# Altium schematic sheet PULSERA.SchDoc
size A4
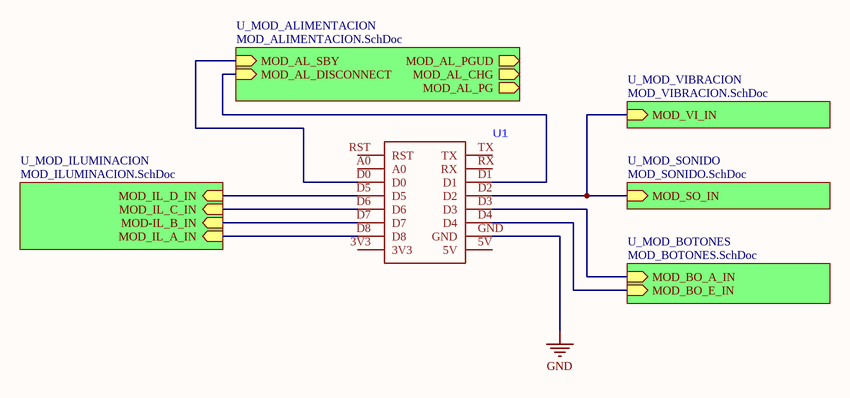
[diagram p0: PULSERA.SchDoc]

## Parts
U1  (no value)  [WEMOS D1 MINI]

## Sub-sheets
U_MOD_ALIMENTACION = MOD_ALIMENTACION.SchDoc: MOD_AL_PGUD (out), MOD_AL_CHG (out), MOD_AL_PG (out), MOD_AL_SBY (in), MOD_AL_DISCONNECT (in)
U_MOD_BOTONES = MOD_BOTONES.SchDoc: MOD_BO_A_IN (in), MOD_BO_E_IN (in)
U_MOD_ILUMINACION = MOD_ILUMINACION.SchDoc: MOD_IL_A_IN (in), MOD-IL_B_IN (in), MOD_IL_C_IN (in), MOD_IL_D_IN (in)
U_MOD_SONIDO = MOD_SONIDO.SchDoc: MOD_SO_IN (in)
U_MOD_VIBRACION = MOD_VIBRACION.SchDoc: MOD_VI_IN (in)

## Nets
GND: U1.GND
NetU1_D0: U1.D0 ; sheet U_MOD_ALIMENTACION/MOD_AL_SBY
NetU1_D1: U1.D1 ; sheet U_MOD_ALIMENTACION/MOD_AL_DISCONNECT
NetU1_D2: U1.D2 ; sheet U_MOD_SONIDO/MOD_SO_IN, sheet U_MOD_VIBRACION/MOD_VI_IN
NetU1_D3: U1.D3 ; sheet U_MOD_BOTONES/MOD_BO_A_IN
NetU1_D4: U1.D4 ; sheet U_MOD_BOTONES/MOD_BO_E_IN
NetU1_D5: U1.D5 ; sheet U_MOD_ILUMINACION/MOD_IL_D_IN
NetU1_D6: U1.D6 ; sheet U_MOD_ILUMINACION/MOD_IL_C_IN
NetU1_D7: U1.D7 ; sheet U_MOD_ILUMINACION/MOD-IL_B_IN
NetU1_D8: U1.D8 ; sheet U_MOD_ILUMINACION/MOD_IL_A_IN

Not connected (* = marked no-connect by the designer): U1 3V3 5V A0 RST RX TX

## Library data of the parts
U1 = WEMOS D1 MINI